# Altium schematic sheet [2]-Charger.SchDoc
size A3
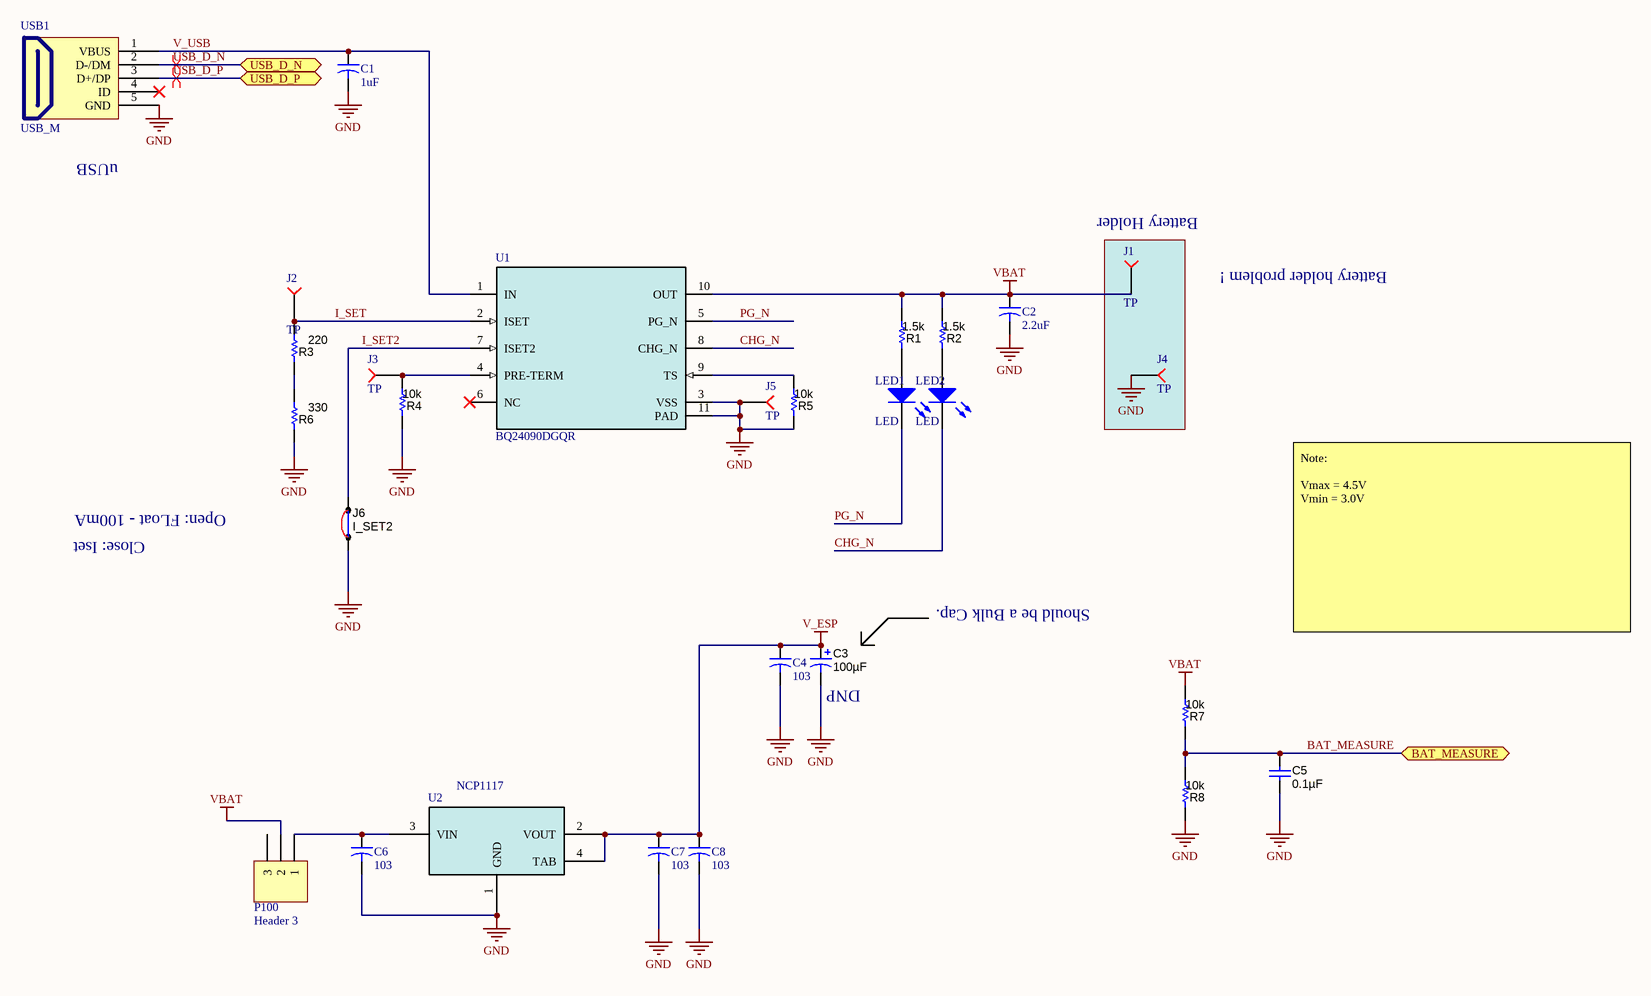
[diagram p0: [2]-Charger.SchDoc]

## Parts
C1  1uF  [0603]
C2  2.2uF  [0603]
C3  ValueDisplayed: 100µF  [3528-21]  (hidden comment: 293D107X96R3B2TE3)
C4  103  [0603]
C5  ValueDisplayed: 0.1µF  [0603]  (hidden comment: 0603YC104JAT2A)
C6  103  [0603]
C7  103  [0603]
C8  103  [0603]
J1  TP  [TP]
J2  TP  [TP]
J3  TP  [TP]
J4  TP  [TP]
J5  TP  [TP]
J6  I_SET2  [HDR1X2]
LED1  LED  [LED-0603-YELLOW]
LED2  LED  [LED-0603-YELLOW]
P100  Header 3  [SW_Slide]
R1  1.5k  [0603]
R2  1.5k  [0603]
R3  220  [0603]
R4  10k  [0603]
R5  10k  [0603]
R6  330  [0603]
R7  10k  [0603]
R8  10k  [0603]
U1  BQ24090DGQR  [DGQ0010D_NV_N]
U2  NCP1117  [SOT-223B_L]
USB1  USB_M  [USB_MICRO_SMD]

## Ports
BAT_MEASURE (bidir), USB_D_N (bidir), USB_D_P (bidir)

## Nets
GND: C1.2 C2.2 C3.2(-) C4.2 C5.2 C6.2 C7.2 C8.2 J4.0 J5.0 J6.1 R4.1 R5.1 R6.1 R8.1 U1.3(VSS) U1.11(PAD) U2.1(GND) USB1.5(GND)
V_ESP: C3.1(+) C4.1 C7.1 C8.1 U2.2(VOUT) U2.4(TAB)
VBAT: C2.1 J1.0 P100.2 R1.2 R2.2 R7.2 U1.10(OUT)
BAT_MEASURE: C5.1 R7.1 R8.2 ; port BAT_MEASURE
CHG_N: LED2.2(K) U1.8(CHG_N)
I_SET: J2.0 R3.2 U1.2(ISET)
I_SET2: J6.2 U1.7(ISET2)
PG_N: LED1.2(K) U1.5(PG_N)
USB_D_N: USB1.2(D-/DM) ; port USB_D_N
USB_D_P: USB1.3(D+/DP) ; port USB_D_P
V_USB: C1.1 U1.1(IN) USB1.1(VBUS)
NetC6_1: C6.1 P100.1 U2.3(VIN)
NetJ3_0: J3.0 R4.2 U1.4(PRE-TERM)
NetLED1_1: LED1.1(A) R1.1
NetLED2_1: LED2.1(A) R2.1
NetR3_1: R3.1 R6.2
NetR5_2: R5.2 U1.9(TS)

Not connected (* = marked no-connect by the designer): P100 3; U1 6(NC)*; USB1 4(ID)*

## Layout directives
differential pair: USB_D_N, USB_D_P

## Notes on the sheet
- uUSB
- (near J1) Battery Holder
- (near J1) Battery holder problem !
- Open: FLoat - 100mA
- Close: Iset
- Should be a Bulk Cap.
- Note:
  Vmax = 4.5V
  Vmin = 3.0V
- (near C3) DNP
- Title
- Size:
- Date:
- A3
- Number:
- Time:
- Revision:
- Sheet
- of
- File:

## Library data of the parts
C1 C2 C4 C6-C8 = Cap 0805: Ceramic; Published: 8-Jun-2000; LatestRevisionDate: 17-Jul-2002; LatestRevisionNote: Re-released for DXP Platform.; PackageReference: POLAR0.8; Publisher: Altium Limited
  C1: Link: http://www.digikey.com/product-detail/en/tdk-corporation/C1608X5R1E105K080AC/445-5146-2-ND/2093414
  C2 C4 C6-C8: Link: http://www.digikey.com/product-detail/en/tdk-corporation/C1608X5R1A225K080AC/445-5166-2-ND/2093434
C3 = C_293D107X96R3B2TE3: CAP, TANT, 100uF, 6.3V, +/-10%, 1.7 ohm, 3528-21 SMD; Manufacturer: Vishay-Sprague; Polarized: Y; CompType: Capacitor; U/M: EA; Cap_F: 0.0001; Tolerance_%: 10; Value1: 1.7 ohm; VDC_V: 6.3; ESR_Ohm: 1.7; IRMS_A: 0.22; TaMin_C: -55; TaMax_C: 125; Cap_Case: B; SymbolVersion: 2008-07-09; Value: 100uF; PartNumber: 293D107X96R3B2TE3; PackageReference: 3528-21; RoHS: Y; Value2: 6.3V; MountType: SMT; Technology: TA; Series: 293D; Published: 2008-06-19; Publisher: Texas Instruments; LatestRevisionDate: 2012-08-28; LatestRevisionNote: Changed Publisher; ComponentLink1Description: Datasheet link; ComponentLink1URL: http://www.vishay.com/docs/40002/293d.pdf; Alternate PartNumber: -; Alternate Manufacturer: -; Supplier 1: Digi-Key; Supplier Part Number 1: 718-1128-1-ND; Supplier 2: Farnell; Supplier Part Number 2: 1616478; Supplier 3: Newark; Supplier Part Number 3: 99M0350
C5 = Cap_0603: CAP, CERM, 0.1uF, 16V, +/-5%, X7R, 0603; Manufacturer: AVX; Polarized: N; CompType: Capacitor; U/M: EA; Cap_F: 0.0000001; Tolerance_%: 5; ESR_Ohm: 0.039; Value1: 0.039 ohm; VDC_V: 16; TaMin_C: -55; TaMax_C: 125; SymbolVersion: 2008-07-09; Value: 0.1uF; PartNumber: 0603YC104JAT2A; PackageReference: 0603; RoHS: Y; Value2: 16V; MountType: SMT; Technology: Ceramic; TempCo: X7R; Cap_Case: 0603; Published: 2008-06-19; Publisher: Texas Instruments; LatestRevisionDate: 2012-08-23; LatestRevisionNote: Changed publisher; ComponentLink1Description: Datasheet link; ComponentLink1URL: http://www.avx.com/docs/masterpubs/smccp.pdf; Alternate PartNumber: -; Alternate Manufacturer: -; Supplier 1: Digi-Key; Supplier Part Number 1: 478-3726-1-ND; Supplier 2: Farnell; Supplier Part Number 2: 1396198; Supplier 3: Arrow; Supplier Part Number 3: 0603YC104JAT2A
J1-J5 = TP: Test point (true); .Sch checked: OK; .PCB  checked: OK
J6 = 923345-02-C: Jumper Wire, 200mil spacing, Red, pkg of 200; Manufacturer: 3M; Alternate Manufacturer: Any; Alternate PartNumber: Equivalent; SymbolCreator: a0412235; U/M: EA; SymbolVersion: 2010-08-18; PartNumber: 923345-02-C; CompType: Jumper Wire; RoHS: Y; PackageReference: 200 mil Jumper Wire; MountType: TH; ComponentLink1Description: Datasheet Link; ComponentLink1URL: http://multimedia.3m.com/mws/mediawebserver?66666UuZjcFSLXTtNX&c5x&6EVuQEcuZgVs6EVs6E666666--; Publisher: Texas Instruments; LatestRevisionDate: 2012-11-04; LatestRevisionNote: Added parts, moved some to Hardware.IntLib; Supplier 1: Digi-Key; Supplier Part Number 1: 923345-02-ND; Supplier 2: Mouser; Supplier Part Number 2: 517-923345-02; Supplier 3: Newark; Supplier Part Number 3: 19M8560
LED1 LED2 = LED: Typical INFRARED GaAs LED; Published: 8-Jun-2000; LatestRevisionDate: 08-Jul-2005; LatestRevisionNote: Mech Layer 1 removed.; PackageReference: LED-0; Publisher: Altium Limited; PackageDescription: LED; 2 Leads
P100 = Header 3: Header, 3-Pin; LatestRevisionDate: 17-Jul-2002; LatestRevisionNote: Re-released for DXP Platform.; Publisher: Altium Limited
R1-R8 = R0805_025W: RES 5%, 0.125W, 0805; PartNumber: CRCW08051K00JNEA; Manufacturer: Vishay-Dale; Alternate Manufacturer: Any; Alternate PartNumber: Equivalent; CompType: Resistor; Res_ohm: 1000; Value_Code: 1k00; Tolerance_%: 5; Power_W: 0.125; VDC_V: 150; TempCo: 200 ppm/C; EIA_Code: E24; U/M: EA; SymbolVersion: 2009-05-29; PackageReference: 0805; RoHS: Y; Value1: 5%; Value2: 0.125W; MountType: SMT; Technology: Thick Film; Published: 2008-06-26; Publisher: Texas Instruments; LatestRevisionDate: 2012-10-04; LatestRevisionNote: Changed publisher; ComponentLink1Description: Datasheet link; ComponentLink1URL: http://www.vishay.com/docs/20035/dcrcwe3.pdf; Supplier 1: Digi-Key; Supplier Part Number 1: 541-1.0KACT-ND; Supplier 2: Farnell; Supplier Part Number 2: 1562615; Supplier 3: Newark; Supplier Part Number 3: 52K9725
  R1 R2: Value: 1.5k
  R3: Value: 220
  R4 R5 R7 R8: Value: 10k
  R6: Value: 330
U1 = BQ24090DGQR: Single Cell Li-Ion and Li-Pol Battery Charger; Alternate PartNumber: BQ24090DGQT; Manufacturer: Texas Instruments; CompType: IC; PIN_COUNT: 11; Application_BuildNumber: *; SymbolVerison: 2014-09-25; PartNumber: BQ24090DGQR; PackageReference: DGQ0010D; MountType: SMT; RoHS: Y; RefDes: RefDes; Type: DEV; Value: Value
U2 = NCP1117: 1000mA Low-Dropout Positive Fixed and Adjustable Voltage Regulators; RefDes: RefDes; Type: DEV; Value: Value; Price (1k-$): 0.15686; Datasheet Link: http://www.onsemi.com/pub_link/Collateral/NCP1117-D.PDF; Digikey Part: NCP1117ST33T3GOSTR-ND